# EAGLE design prog_addapter_rev1.1 (EAGLE 9.3.0)
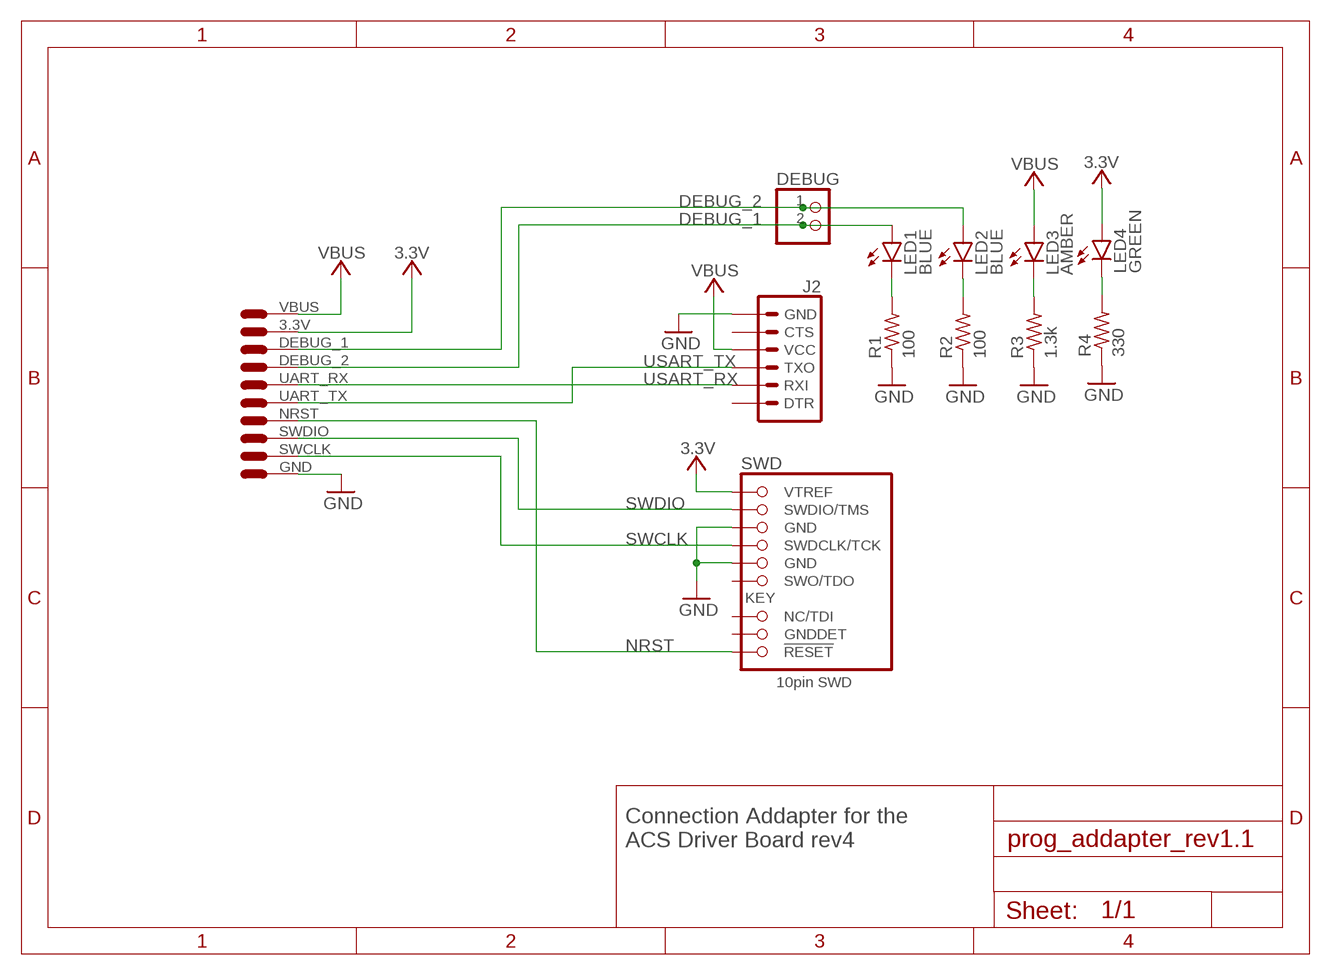
[diagram p0: schematic, sheet 1]

## Parts
DEBUG  PINHD-1X2  [1X02]
J2  6_PIN_SERIAL_TARGETSILK  [6_PIN_SERIAL_TARGET_SIDE_W_SILK]
LED1  BLUE  LEDCHIPLED_0603  [CHIPLED_0603]
LED2  BLUE  LEDCHIPLED_0603  [CHIPLED_0603]
LED3  AMBER  LEDCHIPLED_0603  [CHIPLED_0603]
LED4  GREEN  LEDCHIPLED_0603  [CHIPLED_0603]
R1  100  R-US_0402-B-NOSILK  [.0402-B-NOSILK]
R2  100  R-US_0402-B-NOSILK  [.0402-B-NOSILK]
R3  1.3k  R-US_0402-B-NOSILK  [.0402-B-NOSILK]
R4  330  R-US_0402-B-NOSILK  [.0402-B-NOSILK]
SWD  1.27MM-SWD-CONNECTOR  [1.27MM_2X5]
U$1  DEBUG_CON  [DEBUG_CON]

## Nets
3.3V: LED4.A SWD.VTREF U$1.3.3V
DEBUG_1: DEBUG.1 LED2.A U$1.DEBUG_1
DEBUG_2: DEBUG.2 LED1.A U$1.DEBUG_2
GND: J2.P$6(GND) R1.1 R2.1 R3.1 R4.1 SWD.GND SWD.GND@2(GND) U$1.GND
N$1: LED1.C R1.2
N$2: LED2.C R2.2
N$3: LED3.C R3.2
N$4: LED4.C R4.2
NRST: SWD.!RESET U$1.NRST
SWCLK: SWD.SWDCLK(SWDCLK/TCK) U$1.SWCLK
SWDIO: SWD.SWDIO(SWDIO/TMS) U$1.SWDIO
USART_RX: J2.P$3(RXI) U$1.UART_RX
USART_TX: J2.P$2(TXO) U$1.UART_TX
VBUS: J2.P$4(VCC) LED3.A U$1.VBUS
Unconnected: J2.P$1(DTR) J2.P$5(CTS) SWD.GNDDET SWD.NC(NC/TDI) SWD.SWO(SWO/TDO)

## Notes on the sheet
- Connection Addapter for the 
  ACS Driver Board rev4

## Library data of the parts
DEBUG = pinhead:PINHD-1X2: PIN HEADER
J2 = SparkFun-Connectors:6_PIN_SERIAL_TARGET: 6-pin header connection for use with the "FTDI BASIC" pinout - TARGET SIDE. Also known as "Arduino Serial Program Header". It is used to mate with our FTDI Basic serial programmers using the Arduino IDE. Note, this device has "TARGET" in the name. It is intended to be used on a design that contains a target micro-controller that you wish to program. The "sister" device, named "CABLE" is inteneded to be used on a design that usually lives on the end of your USB cable and prvides the converter chip (FTDI232 or FTDI231x) to commnicate serial RX/TX. You can populate with some of these: Break Away Headers - Straight <https://www.sparkfun.com/products/116> (PRT-00116) For reference (or to suit your programming needs) check out these designs: SparkFun FTDI Basic Breakout - 5V <https://www.sparkfun.com/products/9716> (DEV-09716) SparkFun FTDI Basic Breakout - 3.3V <https://www.sparkfun.com/products/9873> (DEV-09873) SparkFun FTDI SmartBasic <https://www.sparkfun.com/products/12935> (DEV-12935) SparkFun Beefy 3 - FTDI Basic Breakout <https://www.sparkfun.com/products/13746> (DEV-13746)
LED1-LED4 = led:LED: LED OSRAM: - CHIPLED LG R971, LG N971, LY N971, LG Q971, LY Q971, LO R971, LY R971 LH N974, LH R974 LS Q976, LO Q976, LY Q976 LO Q996 - Hyper CHIPLED LW Q18S LB Q993, LB Q99A, LB R99A - SideLED LS A670, LO A670, LY A670, LG A670, LP A670 LB A673, LV A673, LT A673, LW A673 LH A674 LY A675 LS A676, LA A676, LO A676, LY A676, LW A676 LS A679, LY A679, LG A679 - Hyper Micro SIDELED® LS Y876, LA Y876, LO Y876, LY Y876 LT Y87S - SmartLED LW L88C, LW L88S LB L89C, LB L89S, LG L890 LS L89K, LO L89K, LY L89K LS L896, LA L896, LO L896, LY L896 - TOPLED LS T670, LO T670, LY T670, LG T670, LP T670 LSG T670, LSP T670, LSY T670, LOP T670, LYG T670 LG T671, LOG T671, LSG T671 LB T673, LV T673, LT T673, LW T673 LH T674 LS T676, LA T676, LO T676, LY T676, LB T676, LH T676, LSB T676, LW T676 LB T67C, LV T67C, LT T67C, LS T67K, LO T67K, LY T67K, LW E67C LS E67B, LA E67B, LO E67B, LY E67B, LB E67C, LV E67C, LT E67C LW T67C LS T679, LY T679, LG T679 LS T770, LO T770, LY T770, LG T770, LP T770 LB T773, LV T773, LT T773, LW T773 LH T774 LS E675, LA E675, LY E675, LS T675 LS T776, LA T776, LO T776, LY T776, LB T776 LHGB T686 LT T68C, LB T68C - Hyper Mini TOPLED® LB M676 - Mini TOPLED Santana® LG M470 LS M47K, LO M47K, LY M47K Source: http://www.osram.convergy.de LUXEON: - LUMILED® LXK2-PW12-R00, LXK2-PW12-S00, LXK2-PW14-U00, LXK2-PW14-V00 LXK2-PM12-R00, LXK2-PM12-S00, LXK2-PM14-U00 LXK2-PE12-Q00, LXK2-PE12-R00, LXK2-PE12-S00, LXK2-PE14-T00, LXK2-PE14-U00 LXK2-PB12-K00, LXK2-PB12-L00, LXK2-PB12-M00, LXK2-PB14-N00, LXK2-PB14-P00, LXK2-PB14-Q00 LXK2-PR12-L00, LXK2-PR12-M00, LXK2-PR14-Q00, LXK2-PR14-R00 LXK2-PD12-Q00, LXK2-PD12-R00, LXK2-PD12-S00 LXK2-PH12-R00, LXK2-PH12-S00 LXK2-PL12-P00, LXK2-PL12-Q00, LXK2-PL12-R00 Source: www.luxeon.com KINGBRIGHT: KA-3528ASYC Source: www.kingbright.com
R1-R4 = oresat-rcl:R-US_: RESISTOR, American symbol
SWD = J-CNC-3220-10-0100-00-ARM-SWD-port:1.27MM-SWD-CONNECTOR: ARM SWD Programming Header. Example part is the CNC 3220-10-0100-00
U$1 = oresat-ACS_driver_board:DEBUG_CON

## Board
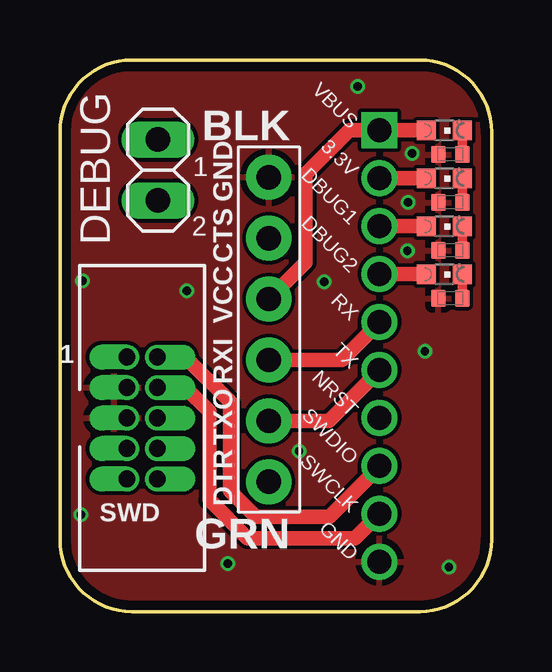
[diagram p1: board, top side]
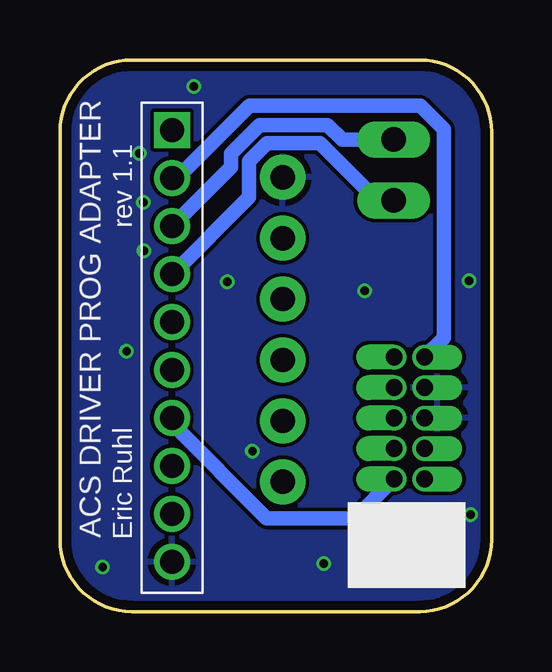
[diagram p2: board, bottom side, seen from below]

Size 18 x 23 mm. Coordinates in mm from the lower left corner, seen from the top.
Outline: 3,0 arc-90 0,3 0,20 arc-90 3,23 15,23 arc-90 18,20 18,3 arc-90 15,0 3,0
Copper layers (1*16): Top 0.035559375mm / dielectric 1.6mm / Bottom 0.035559375mm
Design rules "Osh park 2 layer *": minimum track width 6mil, minimum drill 10mil, track to track 6mil, track to pad 6mil, pad to pad 6mil, via to via 6mil, smd to smd 6mil, copper to edge 15mil, drill to drill 6mil, minimum pad ring 5mil, minimum via ring 5mil, stop-mask expansion 2.5mil, vias tented up to drill 0.4mm, thermal gap 10mil

### Footprints (pad centres in the part's own frame; a part is rotated, then mirrored left to right if it is on the bottom)
1X02 = drill 1.016 long: 1 -1.27,0; 2 1.27,0
6_PIN_SERIAL_TARGET_SIDE_W_SILK = drill 1.016 pad 1.88: P$1 -6.35,0; P$2 -3.81,0; P$3 -1.27,0; P$4 1.27,0; P$5 3.81,0; P$6 6.35,0
CHIPLED_0603 = smd 0.8 x 0.8: A 0,-0.75; C 0,0.75
.0402-B-NOSILK = smd 0.6 x 0.7: 1 -0.5,0; 2 0.5,0
1.27MM_2X5 = drill 0.7 pad 1.016 offset: !RESET 0.635,-2.54; GND -0.635,1.27; GND@2 -0.635,0; GNDDET -0.635,-2.54; KEY -0.635,-1.27; NC 0.635,-1.27; SWDCLK 0.635,1.27; SWDIO 0.635,2.54; SWO 0.635,0; VTREF -0.635,2.54
DEBUG_CON = drill 1: 3.3V 0,6; DEBUG_1 0,4; DEBUG_2 0,2; GND 0,-10; NRST 0,-4; SWCLK 0,-8; SWDIO 0,-6; UART_RX 0,0; UART_TX 0,-2 | drill 1 square: VBUS 0,8

### Placement (x,y rotation side)
DEBUG  4.09,18.41 270 top
J2  8.71,11.76 90 top
LED1  16.03,14.06 270 top
LED2  16.03,16.06 270 top
LED3  16.03,20.06 270 top
LED4  16.03,18.06 270 top
R1  16.28,13.06 0 top
R2  16.28,15.06 0 top
R3  16.28,19.06 0 top
R4  16.28,17.06 0 top
SWD  3.43,8.07 0 top
U$1  13.33,12.08 0 bottom

### Tracks (layer width: path | path; a pad name or v marks a point on that pad's centre or on a via)
3.3V
  Top 0.61: U$1.3.3V 15.26,18.08 LED4.A
  Bottom 0.61: SWD.VTREF 2,11.4 2,20.12 2.97,21.09 10.1,21.09 13.11,18.08 U$1.3.3V
DEBUG_1
  Top 0.61: U$1.DEBUG_1 15.26,16.08 LED2.A
  Bottom 0.61: DEBUG.1 6.23,19.68 6.84,20.29 9.67,20.29 10.87,19.09 10.87,18.54 U$1.DEBUG_1
DEBUG_2
  Top 0.61: U$1.DEBUG_2 15.26,14.08 LED1.A
  Bottom 0.61: DEBUG.2 4.76,17.14 7.15,19.53 9.36,19.53 10.11,18.78 10.11,17.28 13.31,14.08 U$1.DEBUG_2
GND  (via drill 0.35)
  other vias: 14.49,15.04 14.52,17.06 14.69,19.1 7,2 9.97,6.69 5.29,13.38 11.02,13.75 12.41,21.9 15.22,10.86 0.94,13.79 0.87,4.05 16.22,1.86
  pour Bottom (rank 6): 3,0 arc-90 0,3 0,20 arc-90 3,23 15,23 arc-90 18,20 18,3 arc-90 15,0
  pour Top (rank 6): 3,0 arc-90 0,3 0,20 arc-90 3,23 15,23 arc-90 18,20 18,3 arc-90 15,0
N$1
  Top 0.4: LED1.C R1.2
N$2
  Top 0.4: LED2.C R2.2
N$3
  Top 0.4: LED3.C R3.2
N$4
  Top 0.4: LED4.C R4.2
NRST
  Bottom 0.61: SWD.!RESET 5.71,3.89 9.38,3.89 13.33,7.84 U$1.NRST
SWCLK
  Top 0.61: SWD.SWDCLK 5.24,9.33 6.23,8.34 6.23,4.66 7.83,3.06 12.31,3.06 U$1.SWCLK
SWDIO
  Top 0.61: SWD.SWDIO 4.08,10.62 5.22,10.62 7.09,8.75 7.09,5.02 8.17,3.94 11.25,3.94 13.33,6.02 U$1.SWDIO
USART_RX
  Top 0.61: J2.P$3 11.76,10.49 13.33,12.06 U$1.UART_RX
USART_TX
  Top 0.61: J2.P$2 11.22,7.95 13.33,10.06 U$1.UART_TX
VBUS
  Top 0.61: J2.P$4 10.24,14.56 10.24,18.24 12.08,20.08 U$1.VBUS 15.26,20.08 LED3.A

### Text on the board
tPlace: 1 | 2
tNames: VBUS | 3.3V | DBUG1 | DBUG2 | RX | TX | NRST | SWDIO | SWCLK | GND
bNames: rev 1.1 | Eric Ruhl | ACS DRIVER PROG ADAPTER